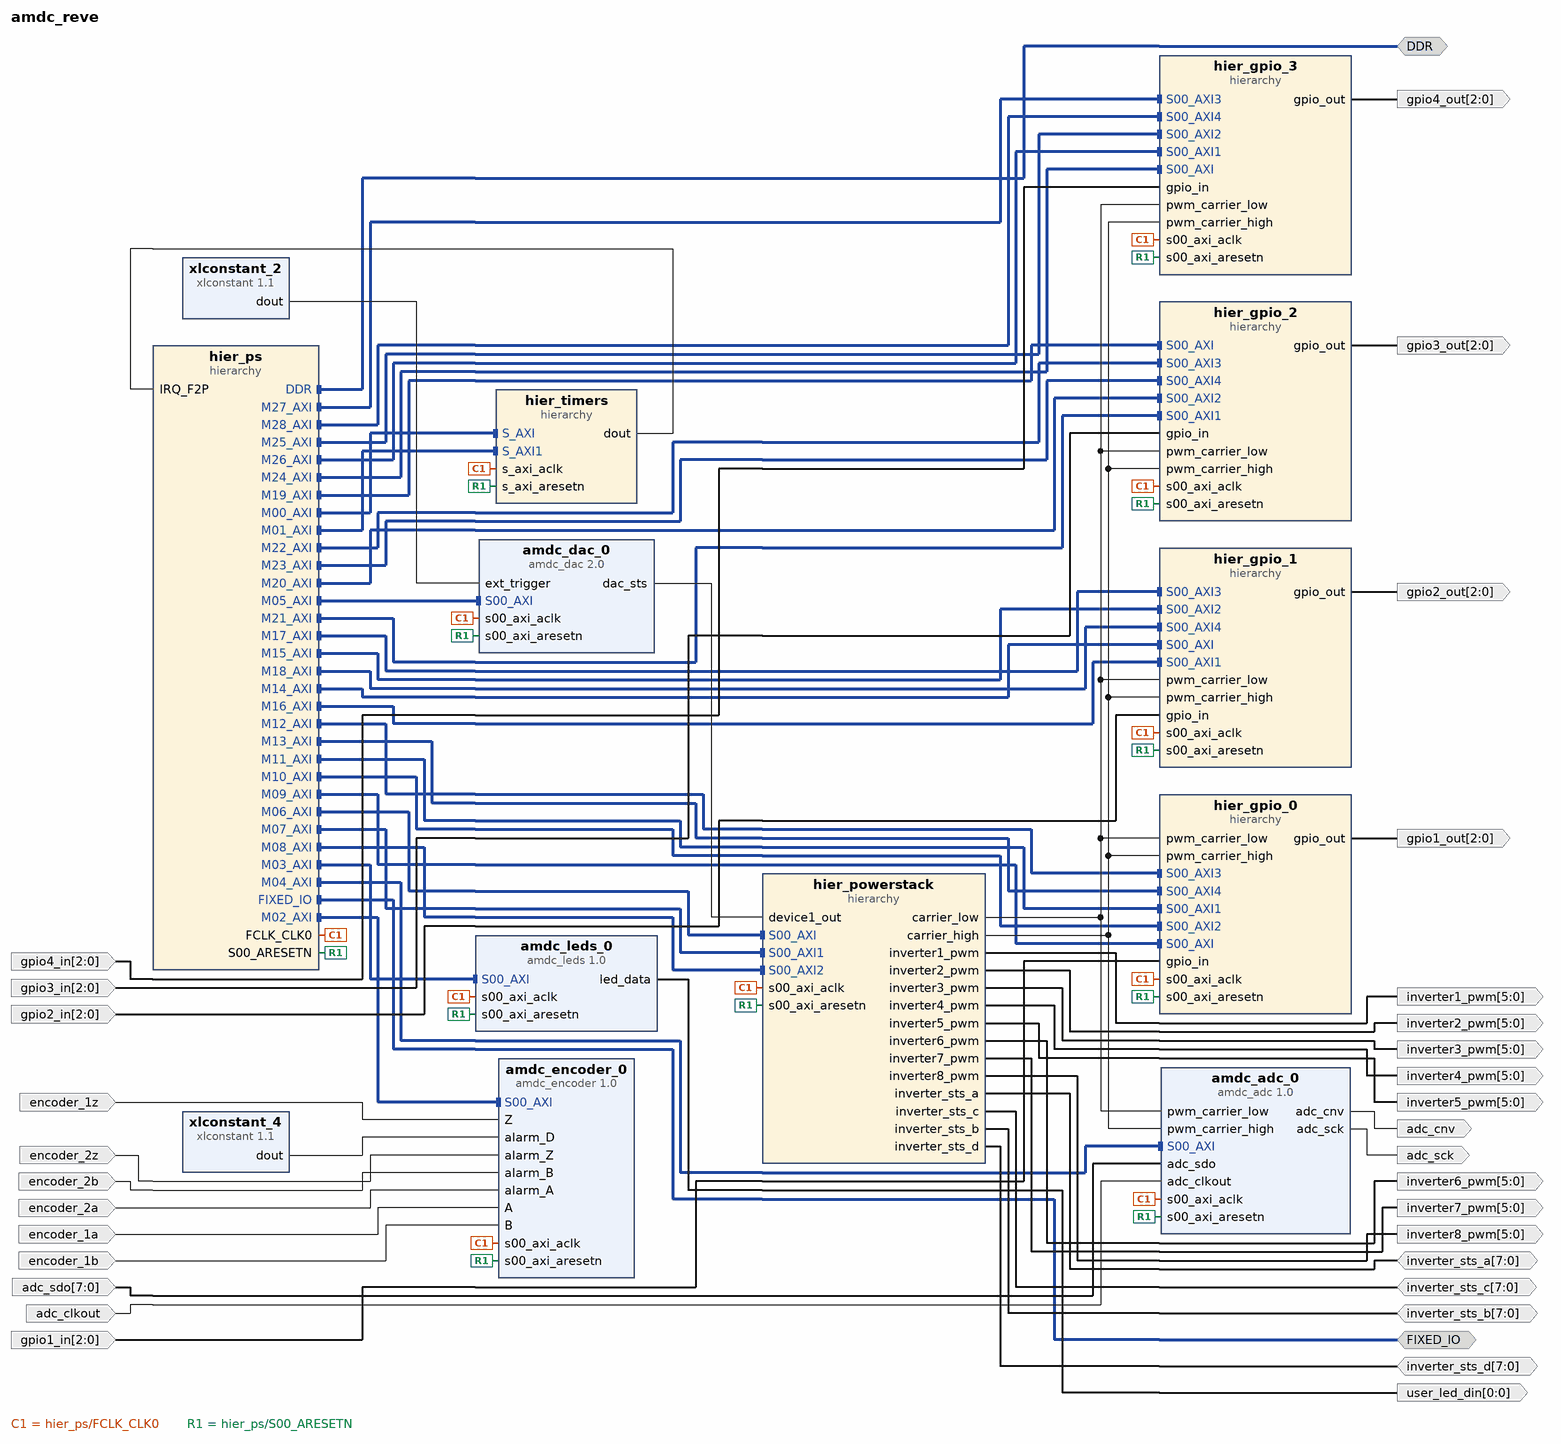
[diagram p0: block diagram of the top level]
# Vivado block design amdc_reve, xc7z030sbg485-1, Vivado 2019.1
create_bd_design amdc_reve

create_bd_intf_port -mode Master -vlnv xilinx.com:interface:ddrx_rtl:1.0 DDR
create_bd_intf_port -mode Master -vlnv xilinx.com:display_processing_system7:fixedio_rtl:1.0 FIXED_IO
create_bd_port -dir I -from 7 -to 0 -type data adc_sdo
create_bd_port -dir I -type data adc_clkout
create_bd_port -dir O -type data adc_sck
create_bd_port -dir O -type data adc_cnv
create_bd_port -dir I -type data encoder_1z
create_bd_port -dir I -type data encoder_2z
create_bd_port -dir I -type data encoder_2b
create_bd_port -dir I -type data encoder_2a
create_bd_port -dir I -type data encoder_1a
create_bd_port -dir I -type data encoder_1b
create_bd_port -dir O -from 5 -to 0 -type data inverter8_pwm
create_bd_port -dir O -from 5 -to 0 -type data inverter7_pwm
create_bd_port -dir O -from 5 -to 0 -type data inverter6_pwm
create_bd_port -dir O -from 5 -to 0 -type data inverter5_pwm
create_bd_port -dir O -from 5 -to 0 -type data inverter4_pwm
create_bd_port -dir O -from 5 -to 0 -type data inverter3_pwm
create_bd_port -dir O -from 5 -to 0 -type data inverter2_pwm
create_bd_port -dir O -from 5 -to 0 -type data inverter1_pwm
create_bd_port -dir O -from 0 -to 0 -type data user_led_din
create_bd_port -dir IO -from 7 -to 0 inverter_sts_a
create_bd_port -dir IO -from 7 -to 0 inverter_sts_b
create_bd_port -dir IO -from 7 -to 0 inverter_sts_c
create_bd_port -dir IO -from 7 -to 0 inverter_sts_d
create_bd_port -dir I -from 2 -to 0 -type data gpio1_in
create_bd_port -dir I -from 2 -to 0 -type data gpio2_in
create_bd_port -dir I -from 2 -to 0 -type data gpio3_in
create_bd_port -dir I -from 2 -to 0 -type data gpio4_in
create_bd_port -dir O -from 2 -to 0 -type data gpio1_out
create_bd_port -dir O -from 2 -to 0 -type data gpio2_out
create_bd_port -dir O -from 2 -to 0 -type data gpio3_out
create_bd_port -dir O -from 2 -to 0 -type data gpio4_out

create_bd_cell -type ip -vlnv wisc.edu:user:amdc_encoder:1.0 amdc_encoder_0
create_bd_cell -type ip -vlnv xilinx.com:ip:xlconstant:1.1 xlconstant_2
set_property -dict {CONFIG.CONST_VAL 0} [get_bd_cells xlconstant_2]
create_bd_cell -type ip -vlnv xilinx.com:ip:xlconstant:1.1 xlconstant_4
set_property -dict {CONFIG.CONST_VAL 0} [get_bd_cells xlconstant_4]
create_bd_cell -type ip -vlnv wisc.edu:user:amdc_leds:1.0 amdc_leds_0
create_bd_cell -type ip -vlnv wisc.edu:user:amdc_adc:1.0 amdc_adc_0
create_bd_cell -type ip -vlnv wisc.edu:user:amdc_dac:2.0 amdc_dac_0
create_bd_cell -type hier hier_ps
create_bd_cell -type hier hier_powerstack
create_bd_cell -type hier hier_gpio_0
create_bd_cell -type hier hier_timers
create_bd_cell -type hier hier_gpio_1
create_bd_cell -type hier hier_gpio_2
create_bd_cell -type hier hier_gpio_3

# ---- hierarchy /hier_ps ----
current_bd_instance /hier_ps
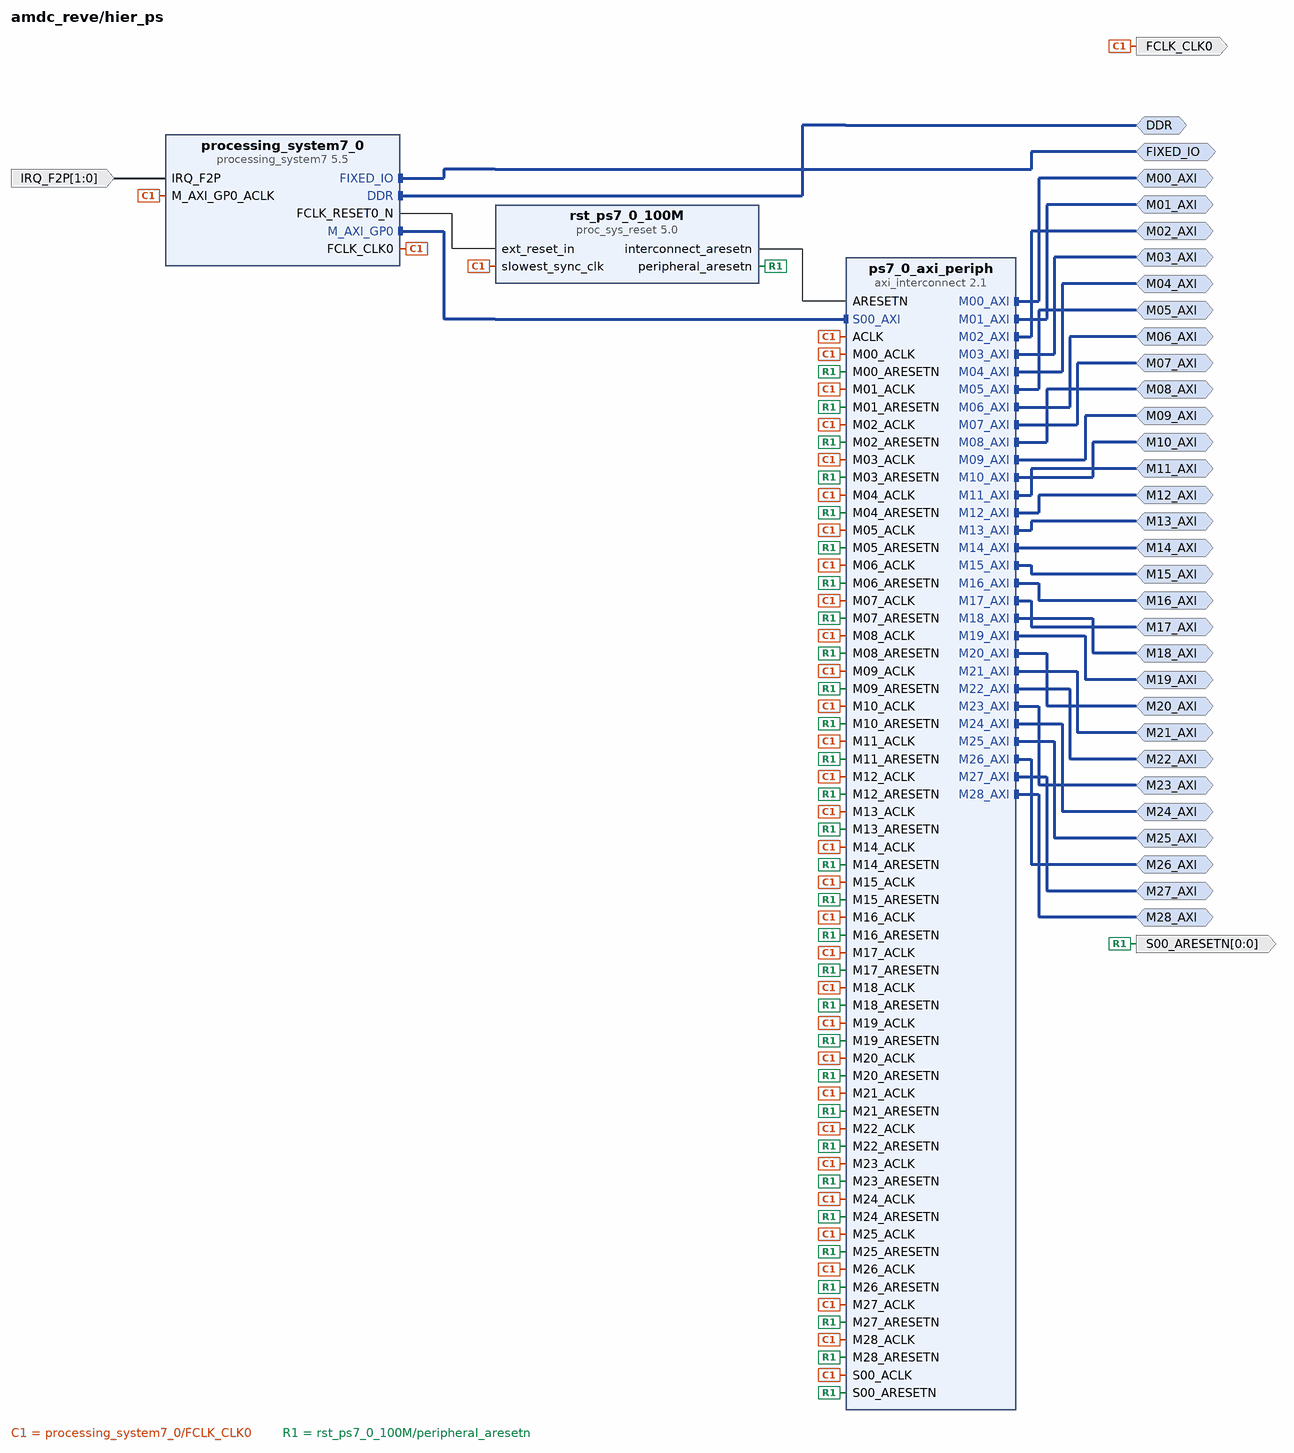
[diagram p1: block diagram inside /hier_ps]
create_bd_intf_pin -mode Master -vlnv xilinx.com:interface:ddrx_rtl:1.0 DDR
create_bd_intf_pin -mode Master -vlnv xilinx.com:display_processing_system7:fixedio_rtl:1.0 FIXED_IO
create_bd_intf_pin -mode Master -vlnv xilinx.com:interface:aximm_rtl:1.0 M00_AXI
create_bd_intf_pin -mode Master -vlnv xilinx.com:interface:aximm_rtl:1.0 M01_AXI
create_bd_intf_pin -mode Master -vlnv xilinx.com:interface:aximm_rtl:1.0 M02_AXI
create_bd_intf_pin -mode Master -vlnv xilinx.com:interface:aximm_rtl:1.0 M03_AXI
create_bd_intf_pin -mode Master -vlnv xilinx.com:interface:aximm_rtl:1.0 M04_AXI
create_bd_intf_pin -mode Master -vlnv xilinx.com:interface:aximm_rtl:1.0 M05_AXI
create_bd_intf_pin -mode Master -vlnv xilinx.com:interface:aximm_rtl:1.0 M06_AXI
create_bd_intf_pin -mode Master -vlnv xilinx.com:interface:aximm_rtl:1.0 M07_AXI
create_bd_intf_pin -mode Master -vlnv xilinx.com:interface:aximm_rtl:1.0 M08_AXI
create_bd_intf_pin -mode Master -vlnv xilinx.com:interface:aximm_rtl:1.0 M09_AXI
create_bd_intf_pin -mode Master -vlnv xilinx.com:interface:aximm_rtl:1.0 M10_AXI
create_bd_intf_pin -mode Master -vlnv xilinx.com:interface:aximm_rtl:1.0 M11_AXI
create_bd_intf_pin -mode Master -vlnv xilinx.com:interface:aximm_rtl:1.0 M12_AXI
create_bd_intf_pin -mode Master -vlnv xilinx.com:interface:aximm_rtl:1.0 M13_AXI
create_bd_intf_pin -mode Master -vlnv xilinx.com:interface:aximm_rtl:1.0 M14_AXI
create_bd_intf_pin -mode Master -vlnv xilinx.com:interface:aximm_rtl:1.0 M15_AXI
create_bd_intf_pin -mode Master -vlnv xilinx.com:interface:aximm_rtl:1.0 M16_AXI
create_bd_intf_pin -mode Master -vlnv xilinx.com:interface:aximm_rtl:1.0 M17_AXI
create_bd_intf_pin -mode Master -vlnv xilinx.com:interface:aximm_rtl:1.0 M18_AXI
create_bd_intf_pin -mode Master -vlnv xilinx.com:interface:aximm_rtl:1.0 M19_AXI
create_bd_intf_pin -mode Master -vlnv xilinx.com:interface:aximm_rtl:1.0 M20_AXI
create_bd_intf_pin -mode Master -vlnv xilinx.com:interface:aximm_rtl:1.0 M21_AXI
create_bd_intf_pin -mode Master -vlnv xilinx.com:interface:aximm_rtl:1.0 M22_AXI
create_bd_intf_pin -mode Master -vlnv xilinx.com:interface:aximm_rtl:1.0 M23_AXI
create_bd_intf_pin -mode Master -vlnv xilinx.com:interface:aximm_rtl:1.0 M24_AXI
create_bd_intf_pin -mode Master -vlnv xilinx.com:interface:aximm_rtl:1.0 M25_AXI
create_bd_intf_pin -mode Master -vlnv xilinx.com:interface:aximm_rtl:1.0 M26_AXI
create_bd_intf_pin -mode Master -vlnv xilinx.com:interface:aximm_rtl:1.0 M27_AXI
create_bd_intf_pin -mode Master -vlnv xilinx.com:interface:aximm_rtl:1.0 M28_AXI
create_bd_pin -dir O -type clk FCLK_CLK0
create_bd_pin -dir O -from 0 -to 0 -type rst S00_ARESETN
create_bd_pin -dir I -from 1 -to 0 -type intr IRQ_F2P

create_bd_cell -type ip -vlnv xilinx.com:ip:processing_system7:5.5 processing_system7_0
set_property -dict [list \
  CONFIG.PCW_APU_PERIPHERAL_FREQMHZ 667 \
  CONFIG.PCW_ENET0_ENET0_IO {MIO 16 .. 27} \
  CONFIG.PCW_ENET0_GRP_MDIO_ENABLE 1 \
  CONFIG.PCW_ENET0_GRP_MDIO_IO {MIO 52 .. 53} \
  CONFIG.PCW_ENET0_PERIPHERAL_ENABLE 1 \
  CONFIG.PCW_ENET0_RESET_ENABLE 0 \
  CONFIG.PCW_ENET_RESET_ENABLE 1 \
  CONFIG.PCW_ENET_RESET_SELECT {Share reset pin} \
  CONFIG.PCW_EN_CLK1_PORT 1 \
  CONFIG.PCW_EN_CLK2_PORT 1 \
  CONFIG.PCW_FCLK_CLK1_BUF TRUE \
  CONFIG.PCW_FCLK_CLK2_BUF TRUE \
  CONFIG.PCW_FPGA0_PERIPHERAL_FREQMHZ 200 \
  CONFIG.PCW_FPGA1_PERIPHERAL_FREQMHZ 50 \
  CONFIG.PCW_FPGA2_PERIPHERAL_FREQMHZ 8 \
  CONFIG.PCW_FPGA_FCLK1_ENABLE 1 \
  CONFIG.PCW_FPGA_FCLK2_ENABLE 1 \
  CONFIG.PCW_GPIO_MIO_GPIO_ENABLE 1 \
  CONFIG.PCW_GPIO_MIO_GPIO_IO MIO \
  CONFIG.PCW_GPIO_PERIPHERAL_ENABLE 1 \
  CONFIG.PCW_I2C_RESET_ENABLE 0 \
  CONFIG.PCW_IRQ_F2P_INTR 1 \
  CONFIG.PCW_P2F_UART0_INTR 1 \
  CONFIG.PCW_PRESET_BANK1_VOLTAGE {LVCMOS 1.8V} \
  CONFIG.PCW_QSPI_GRP_SINGLE_SS_ENABLE 1 \
  CONFIG.PCW_QSPI_GRP_SINGLE_SS_IO {MIO 1 .. 6} \
  CONFIG.PCW_QSPI_PERIPHERAL_ENABLE 1 \
  CONFIG.PCW_QSPI_QSPI_IO {MIO 1 .. 6} \
  CONFIG.PCW_SD0_PERIPHERAL_ENABLE 0 \
  CONFIG.PCW_SD1_GRP_CD_ENABLE 1 \
  CONFIG.PCW_SD1_GRP_CD_IO EMIO \
  CONFIG.PCW_SD1_PERIPHERAL_ENABLE 1 \
  CONFIG.PCW_SD1_SD1_IO {MIO 10 .. 15} \
  CONFIG.PCW_SDIO_PERIPHERAL_FREQMHZ 100 \
  CONFIG.PCW_SINGLE_QSPI_DATA_MODE x4 \
  CONFIG.PCW_UART0_PERIPHERAL_ENABLE 1 \
  CONFIG.PCW_UART0_UART0_IO {MIO 50 .. 51} \
  CONFIG.PCW_UART1_PERIPHERAL_ENABLE 0 \
  CONFIG.PCW_UART_PERIPHERAL_FREQMHZ 50 \
  CONFIG.PCW_UIPARAM_DDR_MEMORY_TYPE {DDR 3 (Low Voltage)} \
  CONFIG.PCW_UIPARAM_DDR_PARTNO {MT41K256M16 RE-125} \
  CONFIG.PCW_USB0_PERIPHERAL_ENABLE 0 \
  CONFIG.PCW_USB_RESET_ENABLE 1 \
  CONFIG.PCW_USE_FABRIC_INTERRUPT 1 \
] [get_bd_cells processing_system7_0]
# 279 more settings of processing_system7_0 are not shown: defaults, MIO pin electricals, DDR timing, and values the tool derives
create_bd_cell -type ip -vlnv xilinx.com:ip:proc_sys_reset:5.0 rst_ps7_0_100M
create_bd_cell -type ip -vlnv xilinx.com:ip:axi_interconnect:2.1 ps7_0_axi_periph
set_property -dict {CONFIG.NUM_MI 29 CONFIG.S00_HAS_DATA_FIFO 2 CONFIG.STRATEGY 2} [get_bd_cells ps7_0_axi_periph]

# ---- hierarchy /hier_powerstack ----
current_bd_instance /hier_powerstack
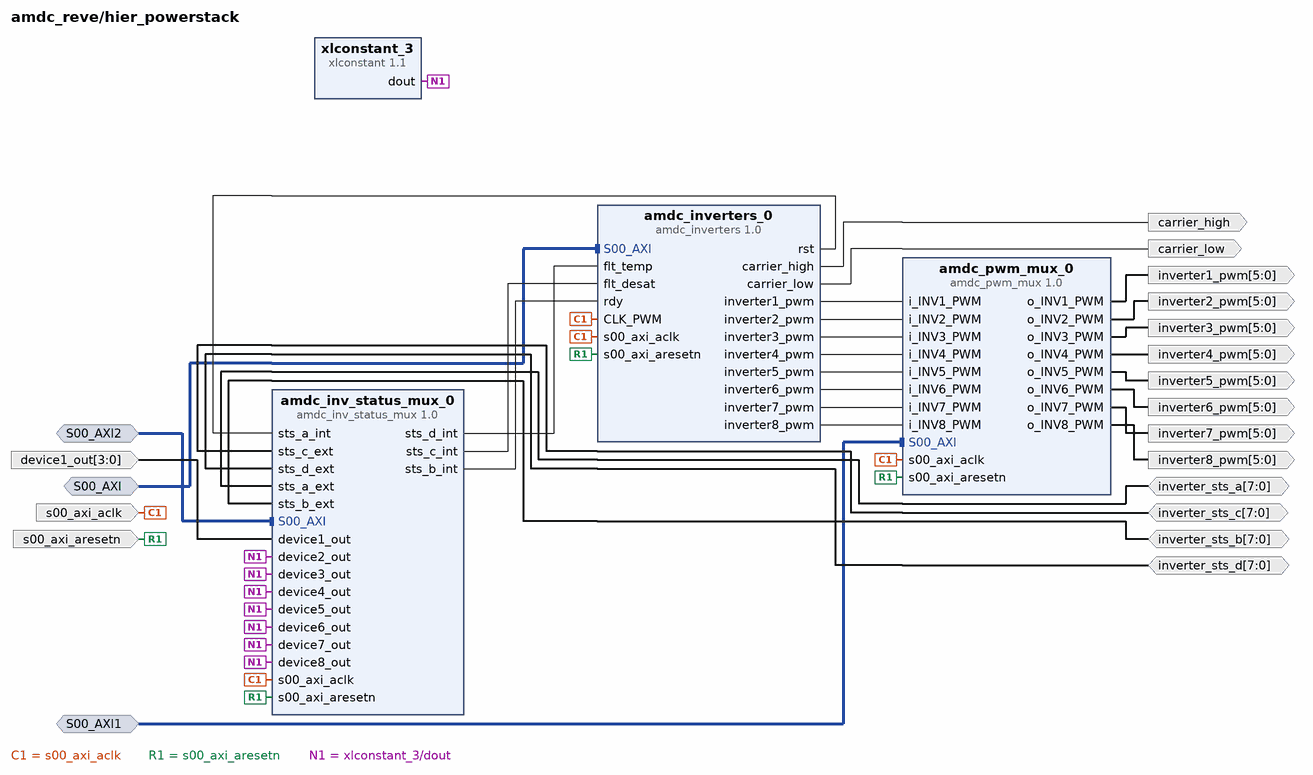
[diagram p2: block diagram inside /hier_powerstack]
create_bd_intf_pin -mode Slave -vlnv xilinx.com:interface:aximm_rtl:1.0 S00_AXI
create_bd_intf_pin -mode Slave -vlnv xilinx.com:interface:aximm_rtl:1.0 S00_AXI1
create_bd_intf_pin -mode Slave -vlnv xilinx.com:interface:aximm_rtl:1.0 S00_AXI2
create_bd_pin -dir I -type clk s00_axi_aclk
create_bd_pin -dir O carrier_high
create_bd_pin -dir O carrier_low
create_bd_pin -dir I -type rst s00_axi_aresetn
create_bd_pin -dir O -from 5 -to 0 inverter1_pwm
create_bd_pin -dir O -from 5 -to 0 inverter2_pwm
create_bd_pin -dir O -from 5 -to 0 inverter3_pwm
create_bd_pin -dir O -from 5 -to 0 inverter4_pwm
create_bd_pin -dir O -from 5 -to 0 inverter5_pwm
create_bd_pin -dir O -from 5 -to 0 inverter6_pwm
create_bd_pin -dir O -from 5 -to 0 inverter7_pwm
create_bd_pin -dir O -from 5 -to 0 inverter8_pwm
create_bd_pin -dir IO -from 7 -to 0 inverter_sts_c
create_bd_pin -dir IO -from 7 -to 0 inverter_sts_d
create_bd_pin -dir I -from 3 -to 0 device1_out
create_bd_pin -dir IO -from 7 -to 0 inverter_sts_a
create_bd_pin -dir IO -from 7 -to 0 inverter_sts_b

create_bd_cell -type ip -vlnv wisc.edu:user:amdc_inverters:1.0 amdc_inverters_0
create_bd_cell -type ip -vlnv wisc.edu:user:amdc_pwm_mux:1.0 amdc_pwm_mux_0
create_bd_cell -type ip -vlnv xilinx.com:user:amdc_inv_status_mux:1.0 amdc_inv_status_mux_0
create_bd_cell -type ip -vlnv xilinx.com:ip:xlconstant:1.1 xlconstant_3
set_property -dict {CONFIG.CONST_VAL 0 CONFIG.CONST_WIDTH 4} [get_bd_cells xlconstant_3]

# ---- hierarchy /hier_gpio_0 ----
current_bd_instance /hier_gpio_0
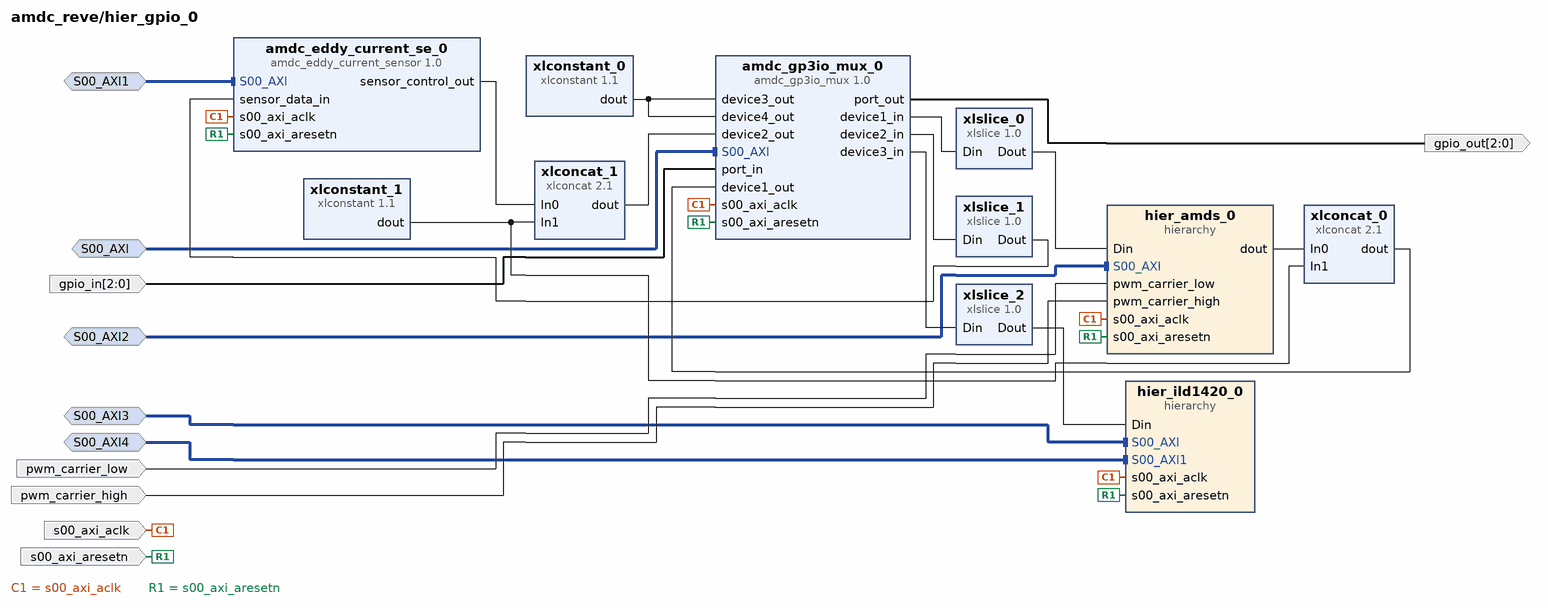
[diagram p3: block diagram inside /hier_gpio_0]
create_bd_intf_pin -mode Slave -vlnv xilinx.com:interface:aximm_rtl:1.0 S00_AXI
create_bd_intf_pin -mode Slave -vlnv xilinx.com:interface:aximm_rtl:1.0 S00_AXI2
create_bd_intf_pin -mode Slave -vlnv xilinx.com:interface:aximm_rtl:1.0 S00_AXI1
create_bd_intf_pin -mode Slave -vlnv xilinx.com:interface:aximm_rtl:1.0 S00_AXI3
create_bd_intf_pin -mode Slave -vlnv xilinx.com:interface:aximm_rtl:1.0 S00_AXI4
create_bd_pin -dir I -from 2 -to 0 gpio_in
create_bd_pin -dir O -from 2 -to 0 gpio_out
create_bd_pin -dir I -type clk s00_axi_aclk
create_bd_pin -dir I -type rst s00_axi_aresetn
create_bd_pin -dir I pwm_carrier_low
create_bd_pin -dir I pwm_carrier_high

create_bd_cell -type hier hier_amds_0
create_bd_cell -type ip -vlnv xilinx.com:user:amdc_eddy_current_sensor:1.0 amdc_eddy_current_se_0
create_bd_cell -type hier hier_ild1420_0
create_bd_cell -type ip -vlnv xilinx.com:ip:xlconstant:1.1 xlconstant_0
set_property -dict {CONFIG.CONST_VAL 0 CONFIG.CONST_WIDTH 3} [get_bd_cells xlconstant_0]
create_bd_cell -type ip -vlnv xilinx.com:user:amdc_gp3io_mux:1.0 amdc_gp3io_mux_0
create_bd_cell -type ip -vlnv xilinx.com:ip:xlconcat:2.1 xlconcat_0
set_property -dict {CONFIG.IN0_WIDTH 2 CONFIG.IN1_WIDTH 1} [get_bd_cells xlconcat_0]
create_bd_cell -type ip -vlnv xilinx.com:ip:xlconstant:1.1 xlconstant_1
set_property -dict {CONFIG.CONST_VAL 0} [get_bd_cells xlconstant_1]
create_bd_cell -type ip -vlnv xilinx.com:ip:xlconcat:2.1 xlconcat_1
set_property -dict {CONFIG.IN0_WIDTH 2 CONFIG.IN1_WIDTH 1} [get_bd_cells xlconcat_1]
create_bd_cell -type ip -vlnv xilinx.com:ip:xlslice:1.0 xlslice_0
set_property -dict {CONFIG.DIN_FROM 1 CONFIG.DIN_TO 0 CONFIG.DIN_WIDTH 3 CONFIG.DOUT_WIDTH 2} [get_bd_cells xlslice_0]
create_bd_cell -type ip -vlnv xilinx.com:ip:xlslice:1.0 xlslice_1
set_property -dict {CONFIG.DIN_FROM 1 CONFIG.DIN_TO 0 CONFIG.DIN_WIDTH 3 CONFIG.DOUT_WIDTH 2} [get_bd_cells xlslice_1]
create_bd_cell -type ip -vlnv xilinx.com:ip:xlslice:1.0 xlslice_2
set_property -dict {CONFIG.DIN_FROM 1 CONFIG.DIN_TO 0 CONFIG.DIN_WIDTH 3 CONFIG.DOUT_WIDTH 2} [get_bd_cells xlslice_2]

# ---- hierarchy /hier_gpio_0/hier_amds_0 ----
current_bd_instance /hier_gpio_0/hier_amds_0
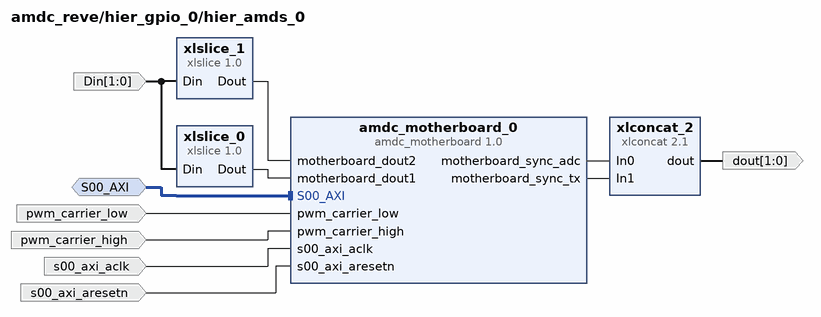
[diagram p4: block diagram inside /hier_gpio_0/hier_amds_0]
create_bd_intf_pin -mode Slave -vlnv xilinx.com:interface:aximm_rtl:1.0 S00_AXI
create_bd_pin -dir I -from 1 -to 0 Din
create_bd_pin -dir O -from 1 -to 0 dout
create_bd_pin -dir I pwm_carrier_low
create_bd_pin -dir I pwm_carrier_high
create_bd_pin -dir I -type clk s00_axi_aclk
create_bd_pin -dir I -type rst s00_axi_aresetn

create_bd_cell -type ip -vlnv xilinx.com:ip:xlslice:1.0 xlslice_0
set_property -dict {CONFIG.DIN_FROM 0 CONFIG.DIN_TO 0 CONFIG.DIN_WIDTH 2} [get_bd_cells xlslice_0]
create_bd_cell -type ip -vlnv xilinx.com:ip:xlconcat:2.1 xlconcat_2
create_bd_cell -type ip -vlnv wisc.edu:user:amdc_motherboard:1.0 amdc_motherboard_0
create_bd_cell -type ip -vlnv xilinx.com:ip:xlslice:1.0 xlslice_1
set_property -dict {CONFIG.DIN_FROM 1 CONFIG.DIN_TO 1 CONFIG.DIN_WIDTH 2 CONFIG.DOUT_WIDTH 1} [get_bd_cells xlslice_1]

# ---- hierarchy /hier_gpio_0/hier_ild1420_0 ----
current_bd_instance /hier_gpio_0/hier_ild1420_0
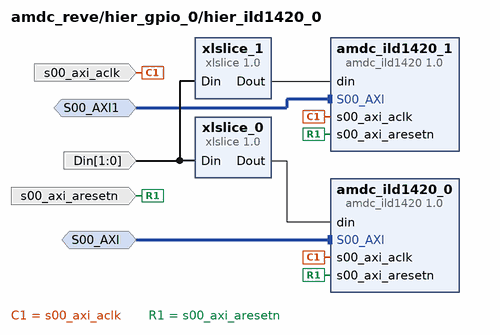
[diagram p5: block diagram inside /hier_gpio_0/hier_ild1420_0]
create_bd_intf_pin -mode Slave -vlnv xilinx.com:interface:aximm_rtl:1.0 S00_AXI
create_bd_intf_pin -mode Slave -vlnv xilinx.com:interface:aximm_rtl:1.0 S00_AXI1
create_bd_pin -dir I -from 1 -to 0 Din
create_bd_pin -dir I -type clk s00_axi_aclk
create_bd_pin -dir I -type rst s00_axi_aresetn

create_bd_cell -type ip -vlnv xilinx.com:ip:xlslice:1.0 xlslice_0
set_property -dict {CONFIG.DIN_FROM 0 CONFIG.DIN_TO 0 CONFIG.DIN_WIDTH 2 CONFIG.DOUT_WIDTH 1} [get_bd_cells xlslice_0]
create_bd_cell -type ip -vlnv xilinx.com:ip:xlslice:1.0 xlslice_1
set_property -dict {CONFIG.DIN_FROM 1 CONFIG.DIN_TO 1 CONFIG.DIN_WIDTH 2 CONFIG.DOUT_WIDTH 1} [get_bd_cells xlslice_1]
create_bd_cell -type ip -vlnv wisc.edu:user:amdc_ild1420:1.0 amdc_ild1420_0
create_bd_cell -type ip -vlnv wisc.edu:user:amdc_ild1420:1.0 amdc_ild1420_1

# ---- hierarchy /hier_timers ----
current_bd_instance /hier_timers
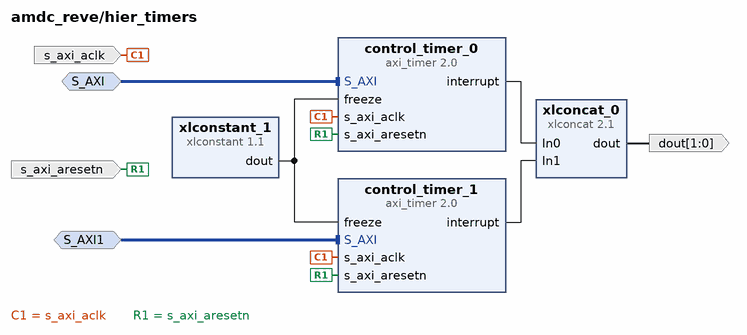
[diagram p6: block diagram inside /hier_timers]
create_bd_intf_pin -mode Slave -vlnv xilinx.com:interface:aximm_rtl:1.0 S_AXI
create_bd_intf_pin -mode Slave -vlnv xilinx.com:interface:aximm_rtl:1.0 S_AXI1
create_bd_pin -dir I -type clk s_axi_aclk
create_bd_pin -dir I -type rst s_axi_aresetn
create_bd_pin -dir O -from 1 -to 0 -type intr dout

create_bd_cell -type ip -vlnv xilinx.com:ip:axi_timer:2.0 control_timer_0
create_bd_cell -type ip -vlnv xilinx.com:ip:axi_timer:2.0 control_timer_1
create_bd_cell -type ip -vlnv xilinx.com:ip:xlconstant:1.1 xlconstant_1
set_property -dict {CONFIG.CONST_VAL 0} [get_bd_cells xlconstant_1]
create_bd_cell -type ip -vlnv xilinx.com:ip:xlconcat:2.1 xlconcat_0
set_property -dict {CONFIG.NUM_PORTS 2} [get_bd_cells xlconcat_0]

# ---- hierarchy /hier_gpio_1 ----
current_bd_instance /hier_gpio_1
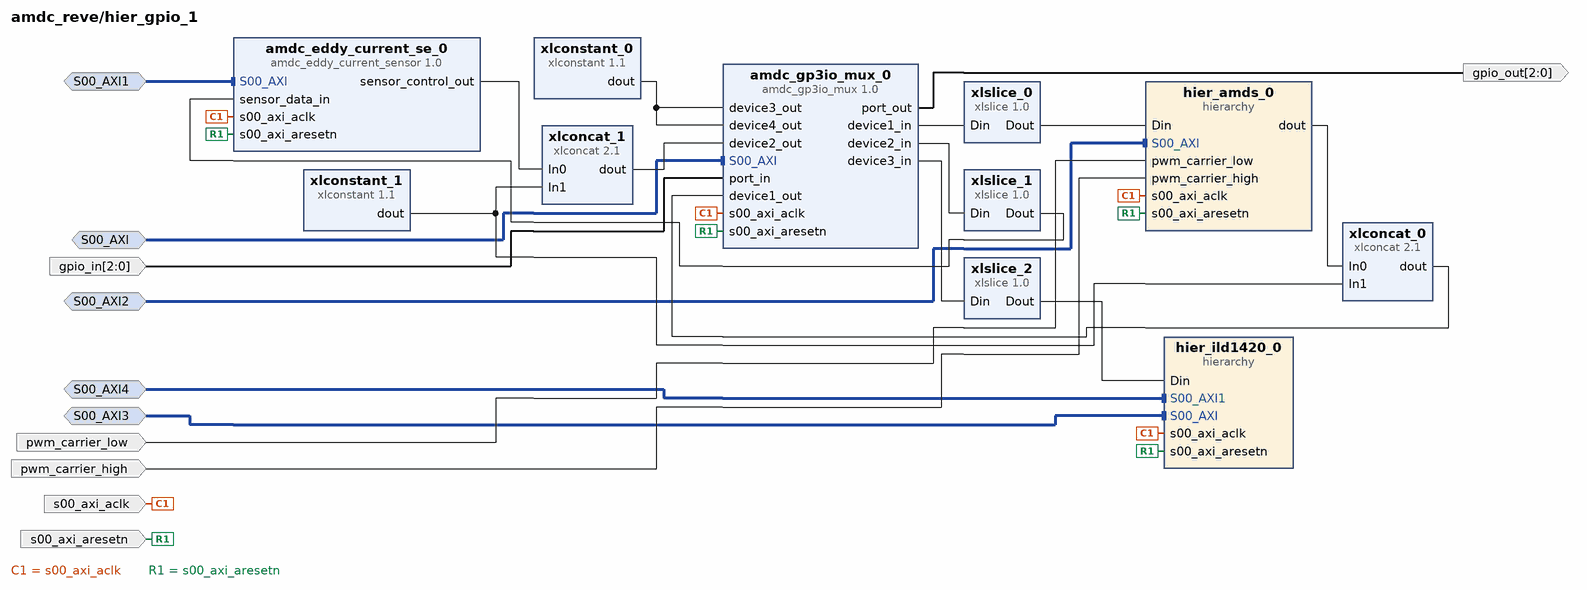
[diagram p7: block diagram inside /hier_gpio_1]
create_bd_intf_pin -mode Slave -vlnv xilinx.com:interface:aximm_rtl:1.0 S00_AXI
create_bd_intf_pin -mode Slave -vlnv xilinx.com:interface:aximm_rtl:1.0 S00_AXI2
create_bd_intf_pin -mode Slave -vlnv xilinx.com:interface:aximm_rtl:1.0 S00_AXI1
create_bd_intf_pin -mode Slave -vlnv xilinx.com:interface:aximm_rtl:1.0 S00_AXI3
create_bd_intf_pin -mode Slave -vlnv xilinx.com:interface:aximm_rtl:1.0 S00_AXI4
create_bd_pin -dir I -from 2 -to 0 gpio_in
create_bd_pin -dir O -from 2 -to 0 gpio_out
create_bd_pin -dir I -type clk s00_axi_aclk
create_bd_pin -dir I -type rst s00_axi_aresetn
create_bd_pin -dir I pwm_carrier_low
create_bd_pin -dir I pwm_carrier_high

create_bd_cell -type hier hier_amds_0
create_bd_cell -type ip -vlnv xilinx.com:user:amdc_eddy_current_sensor:1.0 amdc_eddy_current_se_0
create_bd_cell -type hier hier_ild1420_0
create_bd_cell -type ip -vlnv xilinx.com:ip:xlconstant:1.1 xlconstant_0
set_property -dict {CONFIG.CONST_VAL 0 CONFIG.CONST_WIDTH 3} [get_bd_cells xlconstant_0]
create_bd_cell -type ip -vlnv xilinx.com:user:amdc_gp3io_mux:1.0 amdc_gp3io_mux_0
create_bd_cell -type ip -vlnv xilinx.com:ip:xlconcat:2.1 xlconcat_0
set_property -dict {CONFIG.IN0_WIDTH 2 CONFIG.IN1_WIDTH 1} [get_bd_cells xlconcat_0]
create_bd_cell -type ip -vlnv xilinx.com:ip:xlconstant:1.1 xlconstant_1
set_property -dict {CONFIG.CONST_VAL 0} [get_bd_cells xlconstant_1]
create_bd_cell -type ip -vlnv xilinx.com:ip:xlconcat:2.1 xlconcat_1
set_property -dict {CONFIG.IN0_WIDTH 2 CONFIG.IN1_WIDTH 1} [get_bd_cells xlconcat_1]
create_bd_cell -type ip -vlnv xilinx.com:ip:xlslice:1.0 xlslice_0
set_property -dict {CONFIG.DIN_FROM 1 CONFIG.DIN_TO 0 CONFIG.DIN_WIDTH 3 CONFIG.DOUT_WIDTH 2} [get_bd_cells xlslice_0]
create_bd_cell -type ip -vlnv xilinx.com:ip:xlslice:1.0 xlslice_1
set_property -dict {CONFIG.DIN_FROM 1 CONFIG.DIN_TO 0 CONFIG.DIN_WIDTH 3 CONFIG.DOUT_WIDTH 2} [get_bd_cells xlslice_1]
create_bd_cell -type ip -vlnv xilinx.com:ip:xlslice:1.0 xlslice_2
set_property -dict {CONFIG.DIN_FROM 1 CONFIG.DIN_TO 0 CONFIG.DIN_WIDTH 3 CONFIG.DOUT_WIDTH 2} [get_bd_cells xlslice_2]

# ---- hierarchy /hier_gpio_1/hier_amds_0 ----
current_bd_instance /hier_gpio_1/hier_amds_0
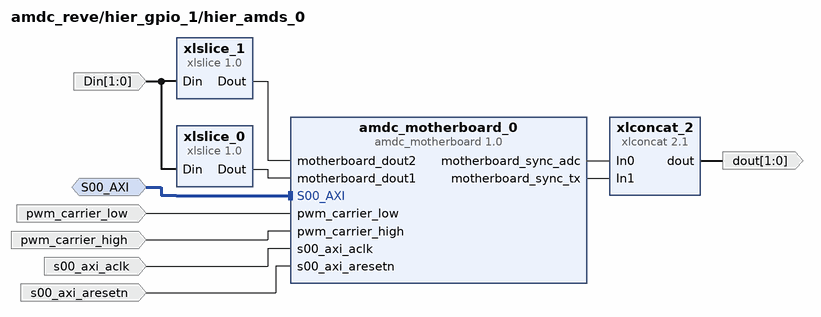
[diagram p8: block diagram inside /hier_gpio_1/hier_amds_0]
create_bd_intf_pin -mode Slave -vlnv xilinx.com:interface:aximm_rtl:1.0 S00_AXI
create_bd_pin -dir I -from 1 -to 0 Din
create_bd_pin -dir O -from 1 -to 0 dout
create_bd_pin -dir I pwm_carrier_low
create_bd_pin -dir I pwm_carrier_high
create_bd_pin -dir I -type clk s00_axi_aclk
create_bd_pin -dir I -type rst s00_axi_aresetn

create_bd_cell -type ip -vlnv xilinx.com:ip:xlslice:1.0 xlslice_0
set_property -dict {CONFIG.DIN_FROM 0 CONFIG.DIN_TO 0 CONFIG.DIN_WIDTH 2} [get_bd_cells xlslice_0]
create_bd_cell -type ip -vlnv xilinx.com:ip:xlconcat:2.1 xlconcat_2
create_bd_cell -type ip -vlnv wisc.edu:user:amdc_motherboard:1.0 amdc_motherboard_0
create_bd_cell -type ip -vlnv xilinx.com:ip:xlslice:1.0 xlslice_1
set_property -dict {CONFIG.DIN_FROM 1 CONFIG.DIN_TO 1 CONFIG.DIN_WIDTH 2 CONFIG.DOUT_WIDTH 1} [get_bd_cells xlslice_1]

# ---- hierarchy /hier_gpio_1/hier_ild1420_0 ----
current_bd_instance /hier_gpio_1/hier_ild1420_0
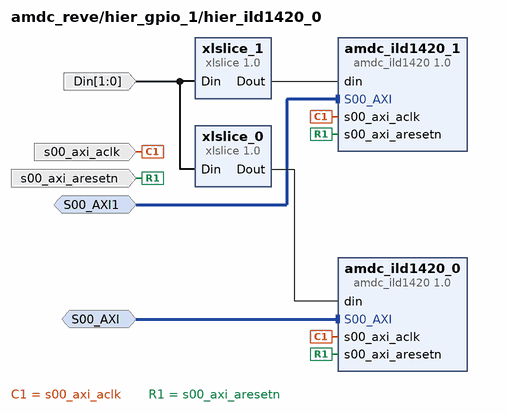
[diagram p9: block diagram inside /hier_gpio_1/hier_ild1420_0]
create_bd_intf_pin -mode Slave -vlnv xilinx.com:interface:aximm_rtl:1.0 S00_AXI
create_bd_intf_pin -mode Slave -vlnv xilinx.com:interface:aximm_rtl:1.0 S00_AXI1
create_bd_pin -dir I -from 1 -to 0 Din
create_bd_pin -dir I -type clk s00_axi_aclk
create_bd_pin -dir I -type rst s00_axi_aresetn

create_bd_cell -type ip -vlnv xilinx.com:ip:xlslice:1.0 xlslice_0
set_property -dict {CONFIG.DIN_FROM 0 CONFIG.DIN_TO 0 CONFIG.DIN_WIDTH 2 CONFIG.DOUT_WIDTH 1} [get_bd_cells xlslice_0]
create_bd_cell -type ip -vlnv xilinx.com:ip:xlslice:1.0 xlslice_1
set_property -dict {CONFIG.DIN_FROM 1 CONFIG.DIN_TO 1 CONFIG.DIN_WIDTH 2 CONFIG.DOUT_WIDTH 1} [get_bd_cells xlslice_1]
create_bd_cell -type ip -vlnv wisc.edu:user:amdc_ild1420:1.0 amdc_ild1420_0
create_bd_cell -type ip -vlnv wisc.edu:user:amdc_ild1420:1.0 amdc_ild1420_1

# ---- hierarchy /hier_gpio_2 ----
current_bd_instance /hier_gpio_2
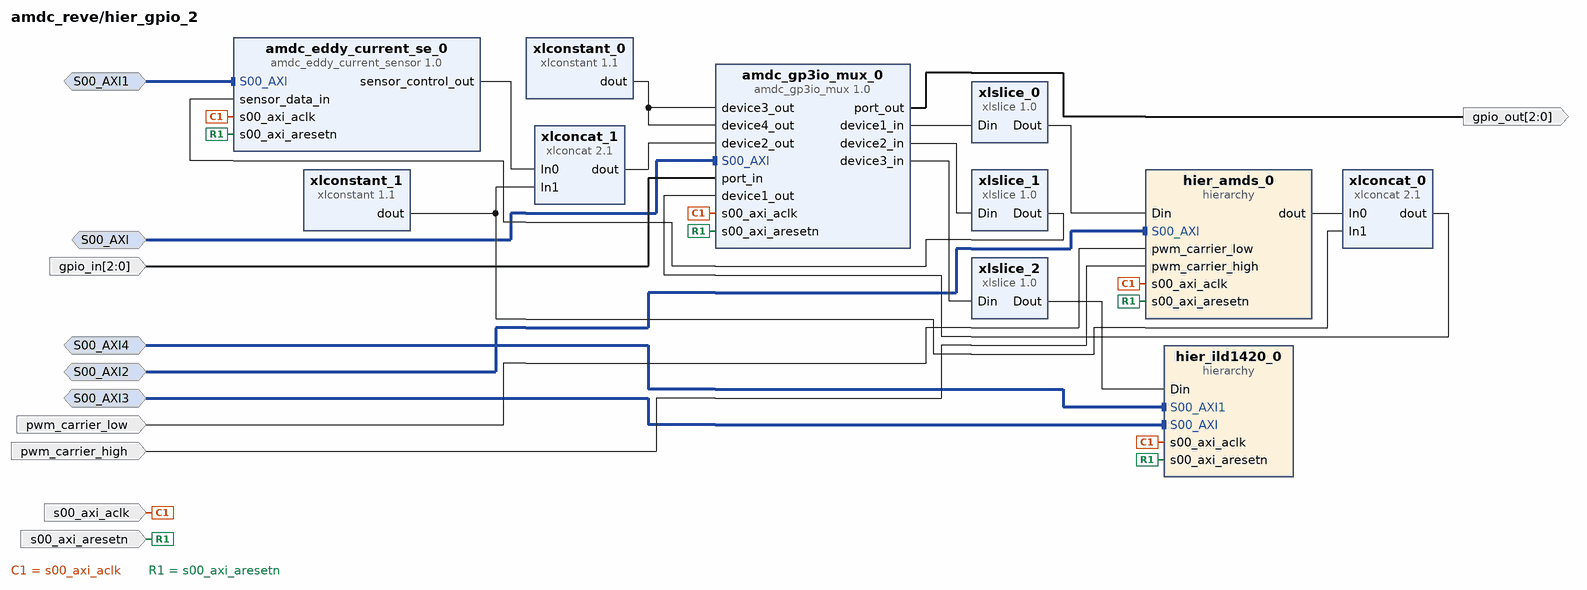
[diagram p10: block diagram inside /hier_gpio_2]
create_bd_intf_pin -mode Slave -vlnv xilinx.com:interface:aximm_rtl:1.0 S00_AXI
create_bd_intf_pin -mode Slave -vlnv xilinx.com:interface:aximm_rtl:1.0 S00_AXI2
create_bd_intf_pin -mode Slave -vlnv xilinx.com:interface:aximm_rtl:1.0 S00_AXI1
create_bd_intf_pin -mode Slave -vlnv xilinx.com:interface:aximm_rtl:1.0 S00_AXI3
create_bd_intf_pin -mode Slave -vlnv xilinx.com:interface:aximm_rtl:1.0 S00_AXI4
create_bd_pin -dir I -from 2 -to 0 gpio_in
create_bd_pin -dir O -from 2 -to 0 gpio_out
create_bd_pin -dir I -type clk s00_axi_aclk
create_bd_pin -dir I -type rst s00_axi_aresetn
create_bd_pin -dir I pwm_carrier_low
create_bd_pin -dir I pwm_carrier_high

create_bd_cell -type hier hier_amds_0
create_bd_cell -type ip -vlnv xilinx.com:user:amdc_eddy_current_sensor:1.0 amdc_eddy_current_se_0
create_bd_cell -type hier hier_ild1420_0
create_bd_cell -type ip -vlnv xilinx.com:ip:xlconstant:1.1 xlconstant_0
set_property -dict {CONFIG.CONST_VAL 0 CONFIG.CONST_WIDTH 3} [get_bd_cells xlconstant_0]
create_bd_cell -type ip -vlnv xilinx.com:user:amdc_gp3io_mux:1.0 amdc_gp3io_mux_0
create_bd_cell -type ip -vlnv xilinx.com:ip:xlconcat:2.1 xlconcat_0
set_property -dict {CONFIG.IN0_WIDTH 2 CONFIG.IN1_WIDTH 1} [get_bd_cells xlconcat_0]
create_bd_cell -type ip -vlnv xilinx.com:ip:xlconstant:1.1 xlconstant_1
set_property -dict {CONFIG.CONST_VAL 0} [get_bd_cells xlconstant_1]
create_bd_cell -type ip -vlnv xilinx.com:ip:xlconcat:2.1 xlconcat_1
set_property -dict {CONFIG.IN0_WIDTH 2 CONFIG.IN1_WIDTH 1} [get_bd_cells xlconcat_1]
create_bd_cell -type ip -vlnv xilinx.com:ip:xlslice:1.0 xlslice_0
set_property -dict {CONFIG.DIN_FROM 1 CONFIG.DIN_TO 0 CONFIG.DIN_WIDTH 3 CONFIG.DOUT_WIDTH 2} [get_bd_cells xlslice_0]
create_bd_cell -type ip -vlnv xilinx.com:ip:xlslice:1.0 xlslice_1
set_property -dict {CONFIG.DIN_FROM 1 CONFIG.DIN_TO 0 CONFIG.DIN_WIDTH 3 CONFIG.DOUT_WIDTH 2} [get_bd_cells xlslice_1]
create_bd_cell -type ip -vlnv xilinx.com:ip:xlslice:1.0 xlslice_2
set_property -dict {CONFIG.DIN_FROM 1 CONFIG.DIN_TO 0 CONFIG.DIN_WIDTH 3 CONFIG.DOUT_WIDTH 2} [get_bd_cells xlslice_2]

# ---- hierarchy /hier_gpio_2/hier_amds_0 ----
current_bd_instance /hier_gpio_2/hier_amds_0
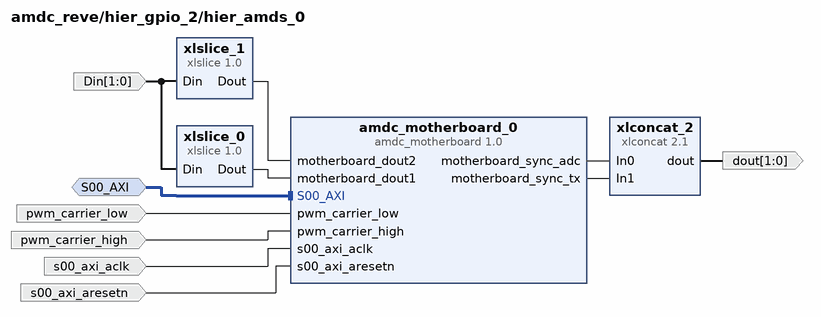
[diagram p11: block diagram inside /hier_gpio_2/hier_amds_0]
create_bd_intf_pin -mode Slave -vlnv xilinx.com:interface:aximm_rtl:1.0 S00_AXI
create_bd_pin -dir I -from 1 -to 0 Din
create_bd_pin -dir O -from 1 -to 0 dout
create_bd_pin -dir I pwm_carrier_low
create_bd_pin -dir I pwm_carrier_high
create_bd_pin -dir I -type clk s00_axi_aclk
create_bd_pin -dir I -type rst s00_axi_aresetn

create_bd_cell -type ip -vlnv xilinx.com:ip:xlslice:1.0 xlslice_0
set_property -dict {CONFIG.DIN_FROM 0 CONFIG.DIN_TO 0 CONFIG.DIN_WIDTH 2} [get_bd_cells xlslice_0]
create_bd_cell -type ip -vlnv xilinx.com:ip:xlconcat:2.1 xlconcat_2
create_bd_cell -type ip -vlnv wisc.edu:user:amdc_motherboard:1.0 amdc_motherboard_0
create_bd_cell -type ip -vlnv xilinx.com:ip:xlslice:1.0 xlslice_1
set_property -dict {CONFIG.DIN_FROM 1 CONFIG.DIN_TO 1 CONFIG.DIN_WIDTH 2 CONFIG.DOUT_WIDTH 1} [get_bd_cells xlslice_1]

# ---- hierarchy /hier_gpio_2/hier_ild1420_0 ----
current_bd_instance /hier_gpio_2/hier_ild1420_0
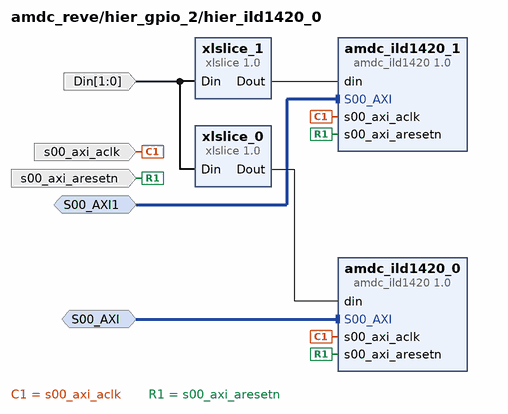
[diagram p12: block diagram inside /hier_gpio_2/hier_ild1420_0]
create_bd_intf_pin -mode Slave -vlnv xilinx.com:interface:aximm_rtl:1.0 S00_AXI
create_bd_intf_pin -mode Slave -vlnv xilinx.com:interface:aximm_rtl:1.0 S00_AXI1
create_bd_pin -dir I -from 1 -to 0 Din
create_bd_pin -dir I -type clk s00_axi_aclk
create_bd_pin -dir I -type rst s00_axi_aresetn

create_bd_cell -type ip -vlnv xilinx.com:ip:xlslice:1.0 xlslice_0
set_property -dict {CONFIG.DIN_FROM 0 CONFIG.DIN_TO 0 CONFIG.DIN_WIDTH 2 CONFIG.DOUT_WIDTH 1} [get_bd_cells xlslice_0]
create_bd_cell -type ip -vlnv xilinx.com:ip:xlslice:1.0 xlslice_1
set_property -dict {CONFIG.DIN_FROM 1 CONFIG.DIN_TO 1 CONFIG.DIN_WIDTH 2 CONFIG.DOUT_WIDTH 1} [get_bd_cells xlslice_1]
create_bd_cell -type ip -vlnv wisc.edu:user:amdc_ild1420:1.0 amdc_ild1420_0
create_bd_cell -type ip -vlnv wisc.edu:user:amdc_ild1420:1.0 amdc_ild1420_1

# ---- hierarchy /hier_gpio_3 ----
current_bd_instance /hier_gpio_3
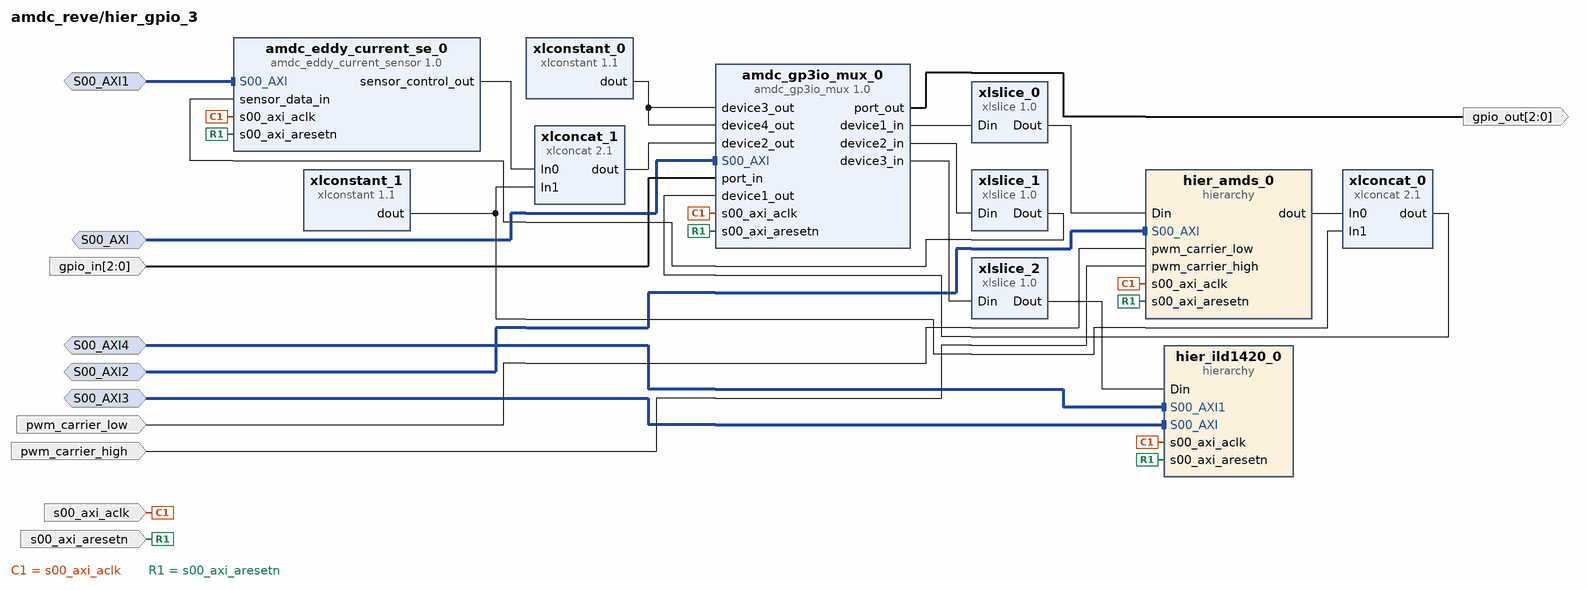
[diagram p13: block diagram inside /hier_gpio_3]
create_bd_intf_pin -mode Slave -vlnv xilinx.com:interface:aximm_rtl:1.0 S00_AXI
create_bd_intf_pin -mode Slave -vlnv xilinx.com:interface:aximm_rtl:1.0 S00_AXI2
create_bd_intf_pin -mode Slave -vlnv xilinx.com:interface:aximm_rtl:1.0 S00_AXI1
create_bd_intf_pin -mode Slave -vlnv xilinx.com:interface:aximm_rtl:1.0 S00_AXI3
create_bd_intf_pin -mode Slave -vlnv xilinx.com:interface:aximm_rtl:1.0 S00_AXI4
create_bd_pin -dir I -from 2 -to 0 gpio_in
create_bd_pin -dir O -from 2 -to 0 gpio_out
create_bd_pin -dir I -type clk s00_axi_aclk
create_bd_pin -dir I -type rst s00_axi_aresetn
create_bd_pin -dir I pwm_carrier_low
create_bd_pin -dir I pwm_carrier_high

create_bd_cell -type hier hier_amds_0
create_bd_cell -type ip -vlnv xilinx.com:user:amdc_eddy_current_sensor:1.0 amdc_eddy_current_se_0
create_bd_cell -type hier hier_ild1420_0
create_bd_cell -type ip -vlnv xilinx.com:ip:xlconstant:1.1 xlconstant_0
set_property -dict {CONFIG.CONST_VAL 0 CONFIG.CONST_WIDTH 3} [get_bd_cells xlconstant_0]
create_bd_cell -type ip -vlnv xilinx.com:user:amdc_gp3io_mux:1.0 amdc_gp3io_mux_0
create_bd_cell -type ip -vlnv xilinx.com:ip:xlconcat:2.1 xlconcat_0
set_property -dict {CONFIG.IN0_WIDTH 2 CONFIG.IN1_WIDTH 1} [get_bd_cells xlconcat_0]
create_bd_cell -type ip -vlnv xilinx.com:ip:xlconstant:1.1 xlconstant_1
set_property -dict {CONFIG.CONST_VAL 0} [get_bd_cells xlconstant_1]
create_bd_cell -type ip -vlnv xilinx.com:ip:xlconcat:2.1 xlconcat_1
set_property -dict {CONFIG.IN0_WIDTH 2 CONFIG.IN1_WIDTH 1} [get_bd_cells xlconcat_1]
create_bd_cell -type ip -vlnv xilinx.com:ip:xlslice:1.0 xlslice_0
set_property -dict {CONFIG.DIN_FROM 1 CONFIG.DIN_TO 0 CONFIG.DIN_WIDTH 3 CONFIG.DOUT_WIDTH 2} [get_bd_cells xlslice_0]
create_bd_cell -type ip -vlnv xilinx.com:ip:xlslice:1.0 xlslice_1
set_property -dict {CONFIG.DIN_FROM 1 CONFIG.DIN_TO 0 CONFIG.DIN_WIDTH 3 CONFIG.DOUT_WIDTH 2} [get_bd_cells xlslice_1]
create_bd_cell -type ip -vlnv xilinx.com:ip:xlslice:1.0 xlslice_2
set_property -dict {CONFIG.DIN_FROM 1 CONFIG.DIN_TO 0 CONFIG.DIN_WIDTH 3 CONFIG.DOUT_WIDTH 2} [get_bd_cells xlslice_2]

# ---- hierarchy /hier_gpio_3/hier_amds_0 ----
current_bd_instance /hier_gpio_3/hier_amds_0
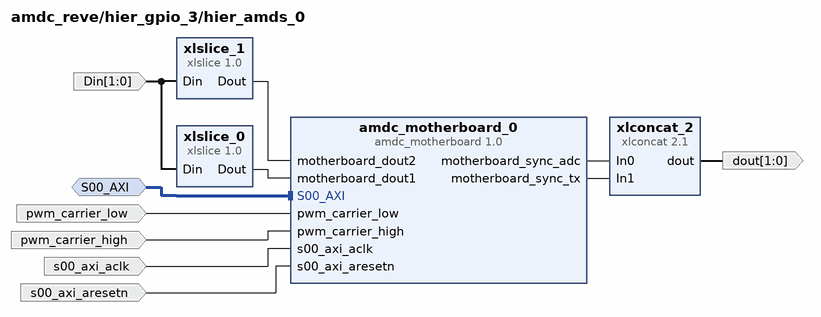
[diagram p14: block diagram inside /hier_gpio_3/hier_amds_0]
create_bd_intf_pin -mode Slave -vlnv xilinx.com:interface:aximm_rtl:1.0 S00_AXI
create_bd_pin -dir I -from 1 -to 0 Din
create_bd_pin -dir O -from 1 -to 0 dout
create_bd_pin -dir I pwm_carrier_low
create_bd_pin -dir I pwm_carrier_high
create_bd_pin -dir I -type clk s00_axi_aclk
create_bd_pin -dir I -type rst s00_axi_aresetn

create_bd_cell -type ip -vlnv xilinx.com:ip:xlslice:1.0 xlslice_0
set_property -dict {CONFIG.DIN_FROM 0 CONFIG.DIN_TO 0 CONFIG.DIN_WIDTH 2} [get_bd_cells xlslice_0]
create_bd_cell -type ip -vlnv xilinx.com:ip:xlconcat:2.1 xlconcat_2
create_bd_cell -type ip -vlnv wisc.edu:user:amdc_motherboard:1.0 amdc_motherboard_0
create_bd_cell -type ip -vlnv xilinx.com:ip:xlslice:1.0 xlslice_1
set_property -dict {CONFIG.DIN_FROM 1 CONFIG.DIN_TO 1 CONFIG.DIN_WIDTH 2 CONFIG.DOUT_WIDTH 1} [get_bd_cells xlslice_1]

# ---- hierarchy /hier_gpio_3/hier_ild1420_0 ----
current_bd_instance /hier_gpio_3/hier_ild1420_0
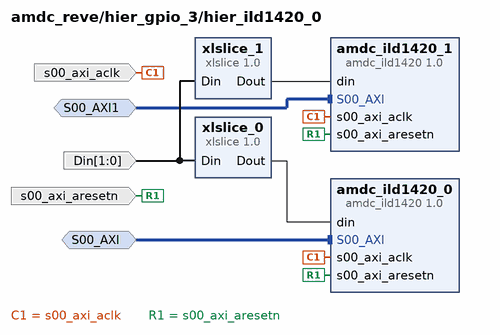
[diagram p15: block diagram inside /hier_gpio_3/hier_ild1420_0]
create_bd_intf_pin -mode Slave -vlnv xilinx.com:interface:aximm_rtl:1.0 S00_AXI
create_bd_intf_pin -mode Slave -vlnv xilinx.com:interface:aximm_rtl:1.0 S00_AXI1
create_bd_pin -dir I -from 1 -to 0 Din
create_bd_pin -dir I -type clk s00_axi_aclk
create_bd_pin -dir I -type rst s00_axi_aresetn

create_bd_cell -type ip -vlnv xilinx.com:ip:xlslice:1.0 xlslice_0
set_property -dict {CONFIG.DIN_FROM 0 CONFIG.DIN_TO 0 CONFIG.DIN_WIDTH 2 CONFIG.DOUT_WIDTH 1} [get_bd_cells xlslice_0]
create_bd_cell -type ip -vlnv xilinx.com:ip:xlslice:1.0 xlslice_1
set_property -dict {CONFIG.DIN_FROM 1 CONFIG.DIN_TO 1 CONFIG.DIN_WIDTH 2 CONFIG.DOUT_WIDTH 1} [get_bd_cells xlslice_1]
create_bd_cell -type ip -vlnv wisc.edu:user:amdc_ild1420:1.0 amdc_ild1420_0
create_bd_cell -type ip -vlnv wisc.edu:user:amdc_ild1420:1.0 amdc_ild1420_1

# ---- connections ----

current_bd_instance /hier_ps
connect_bd_intf_net [get_bd_intf_pins M22_AXI] [get_bd_intf_pins ps7_0_axi_periph/M22_AXI]
connect_bd_intf_net [get_bd_intf_pins M06_AXI] [get_bd_intf_pins ps7_0_axi_periph/M06_AXI]
connect_bd_intf_net [get_bd_intf_pins M11_AXI] [get_bd_intf_pins ps7_0_axi_periph/M11_AXI]
connect_bd_intf_net [get_bd_intf_pins M13_AXI] [get_bd_intf_pins ps7_0_axi_periph/M13_AXI]
connect_bd_intf_net [get_bd_intf_pins M15_AXI] [get_bd_intf_pins ps7_0_axi_periph/M15_AXI]
connect_bd_intf_net [get_bd_intf_pins M21_AXI] [get_bd_intf_pins ps7_0_axi_periph/M21_AXI]
connect_bd_intf_net [get_bd_intf_pins M23_AXI] [get_bd_intf_pins ps7_0_axi_periph/M23_AXI]
connect_bd_intf_net [get_bd_intf_pins M25_AXI] [get_bd_intf_pins ps7_0_axi_periph/M25_AXI]
connect_bd_intf_net [get_bd_intf_pins M16_AXI] [get_bd_intf_pins ps7_0_axi_periph/M16_AXI]
connect_bd_intf_net [get_bd_intf_pins M24_AXI] [get_bd_intf_pins ps7_0_axi_periph/M24_AXI]
connect_bd_intf_net [get_bd_intf_pins M18_AXI] [get_bd_intf_pins ps7_0_axi_periph/M18_AXI]
connect_bd_intf_net [get_bd_intf_pins M19_AXI] [get_bd_intf_pins ps7_0_axi_periph/M19_AXI]
connect_bd_intf_net [get_bd_intf_pins M27_AXI] [get_bd_intf_pins ps7_0_axi_periph/M27_AXI]
connect_bd_intf_net [get_bd_intf_pins M20_AXI] [get_bd_intf_pins ps7_0_axi_periph/M20_AXI]
connect_bd_intf_net [get_bd_intf_pins M26_AXI] [get_bd_intf_pins ps7_0_axi_periph/M26_AXI]
connect_bd_intf_net [get_bd_intf_pins M28_AXI] [get_bd_intf_pins ps7_0_axi_periph/M28_AXI]
connect_bd_intf_net [get_bd_intf_pins M14_AXI] [get_bd_intf_pins ps7_0_axi_periph/M14_AXI]
connect_bd_intf_net [get_bd_intf_pins M03_AXI] [get_bd_intf_pins ps7_0_axi_periph/M03_AXI]
connect_bd_intf_net [get_bd_intf_pins M17_AXI] [get_bd_intf_pins ps7_0_axi_periph/M17_AXI]
connect_bd_intf_net [get_bd_intf_pins FIXED_IO] [get_bd_intf_pins processing_system7_0/FIXED_IO]
connect_bd_intf_net [get_bd_intf_pins M10_AXI] [get_bd_intf_pins ps7_0_axi_periph/M10_AXI]
connect_bd_intf_net [get_bd_intf_pins processing_system7_0/M_AXI_GP0] [get_bd_intf_pins ps7_0_axi_periph/S00_AXI]
connect_bd_intf_net [get_bd_intf_pins M08_AXI] [get_bd_intf_pins ps7_0_axi_periph/M08_AXI]
connect_bd_intf_net [get_bd_intf_pins M00_AXI] [get_bd_intf_pins ps7_0_axi_periph/M00_AXI]
connect_bd_intf_net [get_bd_intf_pins DDR] [get_bd_intf_pins processing_system7_0/DDR]
connect_bd_intf_net [get_bd_intf_pins M02_AXI] [get_bd_intf_pins ps7_0_axi_periph/M02_AXI]
connect_bd_intf_net [get_bd_intf_pins M01_AXI] [get_bd_intf_pins ps7_0_axi_periph/M01_AXI]
connect_bd_intf_net [get_bd_intf_pins M04_AXI] [get_bd_intf_pins ps7_0_axi_periph/M04_AXI]
connect_bd_intf_net [get_bd_intf_pins M05_AXI] [get_bd_intf_pins ps7_0_axi_periph/M05_AXI]
connect_bd_intf_net [get_bd_intf_pins M09_AXI] [get_bd_intf_pins ps7_0_axi_periph/M09_AXI]
connect_bd_intf_net [get_bd_intf_pins M12_AXI] [get_bd_intf_pins ps7_0_axi_periph/M12_AXI]
connect_bd_intf_net [get_bd_intf_pins M07_AXI] [get_bd_intf_pins ps7_0_axi_periph/M07_AXI]
connect_bd_net [get_bd_pins processing_system7_0/FCLK_RESET0_N] [get_bd_pins rst_ps7_0_100M/ext_reset_in]
connect_bd_net [get_bd_pins processing_system7_0/FCLK_CLK0] \
  [get_bd_pins FCLK_CLK0] [get_bd_pins rst_ps7_0_100M/slowest_sync_clk] [get_bd_pins processing_system7_0/M_AXI_GP0_ACLK] \
  [get_bd_pins ps7_0_axi_periph/ACLK] [get_bd_pins ps7_0_axi_periph/S00_ACLK] [get_bd_pins ps7_0_axi_periph/M00_ACLK] \
  [get_bd_pins ps7_0_axi_periph/M01_ACLK] [get_bd_pins ps7_0_axi_periph/M02_ACLK] [get_bd_pins ps7_0_axi_periph/M03_ACLK] \
  [get_bd_pins ps7_0_axi_periph/M04_ACLK] [get_bd_pins ps7_0_axi_periph/M05_ACLK] [get_bd_pins ps7_0_axi_periph/M06_ACLK] \
  [get_bd_pins ps7_0_axi_periph/M07_ACLK] [get_bd_pins ps7_0_axi_periph/M08_ACLK] [get_bd_pins ps7_0_axi_periph/M09_ACLK] \
  [get_bd_pins ps7_0_axi_periph/M10_ACLK] [get_bd_pins ps7_0_axi_periph/M11_ACLK] [get_bd_pins ps7_0_axi_periph/M12_ACLK] \
  [get_bd_pins ps7_0_axi_periph/M13_ACLK] [get_bd_pins ps7_0_axi_periph/M14_ACLK] [get_bd_pins ps7_0_axi_periph/M15_ACLK] \
  [get_bd_pins ps7_0_axi_periph/M16_ACLK] [get_bd_pins ps7_0_axi_periph/M17_ACLK] [get_bd_pins ps7_0_axi_periph/M18_ACLK] \
  [get_bd_pins ps7_0_axi_periph/M19_ACLK] [get_bd_pins ps7_0_axi_periph/M20_ACLK] [get_bd_pins ps7_0_axi_periph/M21_ACLK] \
  [get_bd_pins ps7_0_axi_periph/M22_ACLK] [get_bd_pins ps7_0_axi_periph/M23_ACLK] [get_bd_pins ps7_0_axi_periph/M24_ACLK] \
  [get_bd_pins ps7_0_axi_periph/M25_ACLK] [get_bd_pins ps7_0_axi_periph/M26_ACLK] [get_bd_pins ps7_0_axi_periph/M27_ACLK] \
  [get_bd_pins ps7_0_axi_periph/M28_ACLK]
connect_bd_net [get_bd_pins rst_ps7_0_100M/peripheral_aresetn] \
  [get_bd_pins S00_ARESETN] [get_bd_pins ps7_0_axi_periph/S00_ARESETN] [get_bd_pins ps7_0_axi_periph/M00_ARESETN] \
  [get_bd_pins ps7_0_axi_periph/M01_ARESETN] [get_bd_pins ps7_0_axi_periph/M02_ARESETN] \
  [get_bd_pins ps7_0_axi_periph/M03_ARESETN] [get_bd_pins ps7_0_axi_periph/M04_ARESETN] \
  [get_bd_pins ps7_0_axi_periph/M05_ARESETN] [get_bd_pins ps7_0_axi_periph/M06_ARESETN] \
  [get_bd_pins ps7_0_axi_periph/M07_ARESETN] [get_bd_pins ps7_0_axi_periph/M08_ARESETN] \
  [get_bd_pins ps7_0_axi_periph/M09_ARESETN] [get_bd_pins ps7_0_axi_periph/M10_ARESETN] \
  [get_bd_pins ps7_0_axi_periph/M11_ARESETN] [get_bd_pins ps7_0_axi_periph/M12_ARESETN] \
  [get_bd_pins ps7_0_axi_periph/M13_ARESETN] [get_bd_pins ps7_0_axi_periph/M14_ARESETN] \
  [get_bd_pins ps7_0_axi_periph/M15_ARESETN] [get_bd_pins ps7_0_axi_periph/M16_ARESETN] \
  [get_bd_pins ps7_0_axi_periph/M17_ARESETN] [get_bd_pins ps7_0_axi_periph/M18_ARESETN] \
  [get_bd_pins ps7_0_axi_periph/M19_ARESETN] [get_bd_pins ps7_0_axi_periph/M20_ARESETN] \
  [get_bd_pins ps7_0_axi_periph/M21_ARESETN] [get_bd_pins ps7_0_axi_periph/M22_ARESETN] \
  [get_bd_pins ps7_0_axi_periph/M23_ARESETN] [get_bd_pins ps7_0_axi_periph/M24_ARESETN] \
  [get_bd_pins ps7_0_axi_periph/M25_ARESETN] [get_bd_pins ps7_0_axi_periph/M26_ARESETN] \
  [get_bd_pins ps7_0_axi_periph/M27_ARESETN] [get_bd_pins ps7_0_axi_periph/M28_ARESETN]
connect_bd_net [get_bd_pins rst_ps7_0_100M/interconnect_aresetn] [get_bd_pins ps7_0_axi_periph/ARESETN]
connect_bd_net [get_bd_pins IRQ_F2P] [get_bd_pins processing_system7_0/IRQ_F2P]

current_bd_instance /hier_powerstack
connect_bd_intf_net [get_bd_intf_pins S00_AXI1] [get_bd_intf_pins amdc_pwm_mux_0/S00_AXI]
connect_bd_intf_net [get_bd_intf_pins S00_AXI2] [get_bd_intf_pins amdc_inv_status_mux_0/S00_AXI]
connect_bd_intf_net [get_bd_intf_pins S00_AXI] [get_bd_intf_pins amdc_inverters_0/S00_AXI]
connect_bd_net [get_bd_pins amdc_inverters_0/inverter1_pwm] [get_bd_pins amdc_pwm_mux_0/i_INV1_PWM]
connect_bd_net [get_bd_pins amdc_inverters_0/inverter2_pwm] [get_bd_pins amdc_pwm_mux_0/i_INV2_PWM]
connect_bd_net [get_bd_pins amdc_inverters_0/inverter3_pwm] [get_bd_pins amdc_pwm_mux_0/i_INV3_PWM]
connect_bd_net [get_bd_pins amdc_inverters_0/inverter4_pwm] [get_bd_pins amdc_pwm_mux_0/i_INV4_PWM]
connect_bd_net [get_bd_pins amdc_inverters_0/inverter5_pwm] [get_bd_pins amdc_pwm_mux_0/i_INV5_PWM]
connect_bd_net [get_bd_pins amdc_inverters_0/inverter6_pwm] [get_bd_pins amdc_pwm_mux_0/i_INV6_PWM]
connect_bd_net [get_bd_pins amdc_inverters_0/inverter7_pwm] [get_bd_pins amdc_pwm_mux_0/i_INV7_PWM]
connect_bd_net [get_bd_pins amdc_inverters_0/inverter8_pwm] [get_bd_pins amdc_pwm_mux_0/i_INV8_PWM]
connect_bd_net -net processing_system7_0_FCLK_CLK0 [get_bd_pins s00_axi_aclk] \
  [get_bd_pins amdc_pwm_mux_0/s00_axi_aclk] [get_bd_pins amdc_inverters_0/s00_axi_aclk] \
  [get_bd_pins amdc_inverters_0/CLK_PWM] [get_bd_pins amdc_inv_status_mux_0/s00_axi_aclk]
connect_bd_net [get_bd_pins amdc_inverters_0/carrier_high] [get_bd_pins carrier_high]
connect_bd_net [get_bd_pins amdc_inverters_0/carrier_low] [get_bd_pins carrier_low]
connect_bd_net -net rst_ps7_0_100M_peripheral_aresetn [get_bd_pins s00_axi_aresetn] \
  [get_bd_pins amdc_pwm_mux_0/s00_axi_aresetn] [get_bd_pins amdc_inverters_0/s00_axi_aresetn] \
  [get_bd_pins amdc_inv_status_mux_0/s00_axi_aresetn]
connect_bd_net [get_bd_pins amdc_pwm_mux_0/o_INV1_PWM] [get_bd_pins inverter1_pwm]
connect_bd_net [get_bd_pins amdc_pwm_mux_0/o_INV2_PWM] [get_bd_pins inverter2_pwm]
connect_bd_net [get_bd_pins amdc_pwm_mux_0/o_INV3_PWM] [get_bd_pins inverter3_pwm]
connect_bd_net [get_bd_pins amdc_pwm_mux_0/o_INV4_PWM] [get_bd_pins inverter4_pwm]
connect_bd_net [get_bd_pins amdc_pwm_mux_0/o_INV5_PWM] [get_bd_pins inverter5_pwm]
connect_bd_net [get_bd_pins amdc_pwm_mux_0/o_INV6_PWM] [get_bd_pins inverter6_pwm]
connect_bd_net [get_bd_pins amdc_pwm_mux_0/o_INV7_PWM] [get_bd_pins inverter7_pwm]
connect_bd_net [get_bd_pins amdc_pwm_mux_0/o_INV8_PWM] [get_bd_pins inverter8_pwm]
connect_bd_net [get_bd_pins inverter_sts_c] [get_bd_pins amdc_inv_status_mux_0/sts_c_ext]
connect_bd_net [get_bd_pins inverter_sts_d] [get_bd_pins amdc_inv_status_mux_0/sts_d_ext]
connect_bd_net [get_bd_pins amdc_inverters_0/rst] [get_bd_pins amdc_inv_status_mux_0/sts_a_int]
connect_bd_net [get_bd_pins amdc_inv_status_mux_0/sts_d_int] [get_bd_pins amdc_inverters_0/flt_temp]
connect_bd_net [get_bd_pins amdc_inv_status_mux_0/sts_c_int] [get_bd_pins amdc_inverters_0/flt_desat]
connect_bd_net [get_bd_pins amdc_inv_status_mux_0/sts_b_int] [get_bd_pins amdc_inverters_0/rdy]
connect_bd_net [get_bd_pins device1_out] [get_bd_pins amdc_inv_status_mux_0/device1_out]
connect_bd_net [get_bd_pins inverter_sts_a] [get_bd_pins amdc_inv_status_mux_0/sts_a_ext]
connect_bd_net [get_bd_pins inverter_sts_b] [get_bd_pins amdc_inv_status_mux_0/sts_b_ext]
connect_bd_net -net device3_out_1 [get_bd_pins xlconstant_3/dout] \
  [get_bd_pins amdc_inv_status_mux_0/device3_out] [get_bd_pins amdc_inv_status_mux_0/device4_out] \
  [get_bd_pins amdc_inv_status_mux_0/device5_out] [get_bd_pins amdc_inv_status_mux_0/device6_out] \
  [get_bd_pins amdc_inv_status_mux_0/device7_out] [get_bd_pins amdc_inv_status_mux_0/device8_out] \
  [get_bd_pins amdc_inv_status_mux_0/device2_out]

current_bd_instance /hier_gpio_0
connect_bd_intf_net [get_bd_intf_pins S00_AXI1] [get_bd_intf_pins amdc_eddy_current_se_0/S00_AXI]
connect_bd_intf_net [get_bd_intf_pins S00_AXI2] [get_bd_intf_pins hier_amds_0/S00_AXI]
connect_bd_intf_net [get_bd_intf_pins S00_AXI3] [get_bd_intf_pins hier_ild1420_0/S00_AXI]
connect_bd_intf_net [get_bd_intf_pins S00_AXI] [get_bd_intf_pins amdc_gp3io_mux_0/S00_AXI]
connect_bd_intf_net [get_bd_intf_pins S00_AXI4] [get_bd_intf_pins hier_ild1420_0/S00_AXI1]
connect_bd_net -net gpio1_in_1 [get_bd_pins gpio_in] [get_bd_pins amdc_gp3io_mux_0/port_in]
connect_bd_net [get_bd_pins amdc_gp3io_mux_0/port_out] [get_bd_pins gpio_out]
connect_bd_net -net processing_system7_0_FCLK_CLK0 [get_bd_pins s00_axi_aclk] \
  [get_bd_pins hier_amds_0/s00_axi_aclk] [get_bd_pins amdc_eddy_current_se_0/s00_axi_aclk] \
  [get_bd_pins hier_ild1420_0/s00_axi_aclk] [get_bd_pins amdc_gp3io_mux_0/s00_axi_aclk]
connect_bd_net -net rst_ps7_0_100M_peripheral_aresetn [get_bd_pins s00_axi_aresetn] \
  [get_bd_pins hier_amds_0/s00_axi_aresetn] [get_bd_pins amdc_eddy_current_se_0/s00_axi_aresetn] \
  [get_bd_pins hier_ild1420_0/s00_axi_aresetn] [get_bd_pins amdc_gp3io_mux_0/s00_axi_aresetn]
connect_bd_net [get_bd_pins pwm_carrier_low] [get_bd_pins hier_amds_0/pwm_carrier_low]
connect_bd_net [get_bd_pins pwm_carrier_high] [get_bd_pins hier_amds_0/pwm_carrier_high]
connect_bd_net [get_bd_pins xlconstant_0/dout] [get_bd_pins amdc_gp3io_mux_0/device3_out] [get_bd_pins amdc_gp3io_mux_0/device4_out]
connect_bd_net [get_bd_pins hier_amds_0/dout] [get_bd_pins xlconcat_0/In0]
connect_bd_net [get_bd_pins xlconcat_0/dout] [get_bd_pins amdc_gp3io_mux_0/device1_out]
connect_bd_net [get_bd_pins xlconstant_1/dout] [get_bd_pins xlconcat_0/In1] [get_bd_pins xlconcat_1/In1]
connect_bd_net [get_bd_pins amdc_eddy_current_se_0/sensor_control_out] [get_bd_pins xlconcat_1/In0]
connect_bd_net [get_bd_pins xlconcat_1/dout] [get_bd_pins amdc_gp3io_mux_0/device2_out]
connect_bd_net [get_bd_pins amdc_gp3io_mux_0/device1_in] [get_bd_pins xlslice_0/Din]
connect_bd_net [get_bd_pins xlslice_0/Dout] [get_bd_pins hier_amds_0/Din]
connect_bd_net [get_bd_pins amdc_gp3io_mux_0/device2_in] [get_bd_pins xlslice_1/Din]
connect_bd_net [get_bd_pins xlslice_1/Dout] [get_bd_pins amdc_eddy_current_se_0/sensor_data_in]
connect_bd_net [get_bd_pins amdc_gp3io_mux_0/device3_in] [get_bd_pins xlslice_2/Din]
connect_bd_net -net Din_1 [get_bd_pins xlslice_2/Dout] [get_bd_pins hier_ild1420_0/Din]

current_bd_instance /hier_gpio_0/hier_amds_0
connect_bd_intf_net [get_bd_intf_pins S00_AXI] [get_bd_intf_pins amdc_motherboard_0/S00_AXI]
connect_bd_net [get_bd_pins xlslice_0/Dout] [get_bd_pins amdc_motherboard_0/motherboard_dout1]
connect_bd_net [get_bd_pins amdc_motherboard_0/motherboard_sync_adc] [get_bd_pins xlconcat_2/In0]
connect_bd_net [get_bd_pins amdc_motherboard_0/motherboard_sync_tx] [get_bd_pins xlconcat_2/In1]
connect_bd_net [get_bd_pins xlslice_1/Dout] [get_bd_pins amdc_motherboard_0/motherboard_dout2]
connect_bd_net -net amdc_gpio_mux_0_device_in_2 [get_bd_pins Din] [get_bd_pins xlslice_1/Din] [get_bd_pins xlslice_0/Din]
connect_bd_net [get_bd_pins xlconcat_2/dout] [get_bd_pins dout]
connect_bd_net -net amdc_inverters_0_carrier_low [get_bd_pins pwm_carrier_low] [get_bd_pins amdc_motherboard_0/pwm_carrier_low]
connect_bd_net -net amdc_inverters_0_carrier_high [get_bd_pins pwm_carrier_high] [get_bd_pins amdc_motherboard_0/pwm_carrier_high]
connect_bd_net -net processing_system7_0_FCLK_CLK0 [get_bd_pins s00_axi_aclk] [get_bd_pins amdc_motherboard_0/s00_axi_aclk]
connect_bd_net -net rst_ps7_0_100M_peripheral_aresetn [get_bd_pins s00_axi_aresetn] [get_bd_pins amdc_motherboard_0/s00_axi_aresetn]

current_bd_instance /hier_gpio_0/hier_ild1420_0
connect_bd_intf_net [get_bd_intf_pins S00_AXI1] [get_bd_intf_pins amdc_ild1420_1/S00_AXI]
connect_bd_intf_net [get_bd_intf_pins S00_AXI] [get_bd_intf_pins amdc_ild1420_0/S00_AXI]
connect_bd_net [get_bd_pins xlslice_0/Dout] [get_bd_pins amdc_ild1420_0/din]
connect_bd_net [get_bd_pins xlslice_1/Dout] [get_bd_pins amdc_ild1420_1/din]
connect_bd_net -net amdc_gpio_mux_0_device_in_3 [get_bd_pins Din] [get_bd_pins xlslice_1/Din] [get_bd_pins xlslice_0/Din]
connect_bd_net -net processing_system7_0_FCLK_CLK0 [get_bd_pins s00_axi_aclk] \
  [get_bd_pins amdc_ild1420_0/s00_axi_aclk] [get_bd_pins amdc_ild1420_1/s00_axi_aclk]
connect_bd_net -net rst_ps7_0_100M_peripheral_aresetn [get_bd_pins s00_axi_aresetn] \
  [get_bd_pins amdc_ild1420_0/s00_axi_aresetn] [get_bd_pins amdc_ild1420_1/s00_axi_aresetn]

current_bd_instance /hier_timers
connect_bd_intf_net [get_bd_intf_pins S_AXI1] [get_bd_intf_pins control_timer_1/S_AXI]
connect_bd_intf_net [get_bd_intf_pins S_AXI] [get_bd_intf_pins control_timer_0/S_AXI]
connect_bd_net [get_bd_pins xlconstant_1/dout] [get_bd_pins control_timer_1/freeze] [get_bd_pins control_timer_0/freeze]
connect_bd_net -net processing_system7_0_FCLK_CLK0 [get_bd_pins s_axi_aclk] \
  [get_bd_pins control_timer_1/s_axi_aclk] [get_bd_pins control_timer_0/s_axi_aclk]
connect_bd_net -net rst_ps7_0_100M_peripheral_aresetn [get_bd_pins s_axi_aresetn] \
  [get_bd_pins control_timer_1/s_axi_aresetn] [get_bd_pins control_timer_0/s_axi_aresetn]
connect_bd_net [get_bd_pins control_timer_1/interrupt] [get_bd_pins xlconcat_0/In1]
connect_bd_net [get_bd_pins control_timer_0/interrupt] [get_bd_pins xlconcat_0/In0]
connect_bd_net [get_bd_pins xlconcat_0/dout] [get_bd_pins dout]

current_bd_instance /hier_gpio_1
connect_bd_intf_net [get_bd_intf_pins S00_AXI4] [get_bd_intf_pins hier_ild1420_0/S00_AXI1]
connect_bd_intf_net [get_bd_intf_pins S00_AXI] [get_bd_intf_pins amdc_gp3io_mux_0/S00_AXI]
connect_bd_intf_net [get_bd_intf_pins S00_AXI1] [get_bd_intf_pins amdc_eddy_current_se_0/S00_AXI]
connect_bd_intf_net [get_bd_intf_pins S00_AXI2] [get_bd_intf_pins hier_amds_0/S00_AXI]
connect_bd_intf_net [get_bd_intf_pins S00_AXI3] [get_bd_intf_pins hier_ild1420_0/S00_AXI]
connect_bd_net -net gpio1_in_1 [get_bd_pins gpio_in] [get_bd_pins amdc_gp3io_mux_0/port_in]
connect_bd_net [get_bd_pins amdc_gp3io_mux_0/port_out] [get_bd_pins gpio_out]
connect_bd_net -net processing_system7_0_FCLK_CLK0 [get_bd_pins s00_axi_aclk] \
  [get_bd_pins hier_amds_0/s00_axi_aclk] [get_bd_pins amdc_eddy_current_se_0/s00_axi_aclk] \
  [get_bd_pins hier_ild1420_0/s00_axi_aclk] [get_bd_pins amdc_gp3io_mux_0/s00_axi_aclk]
connect_bd_net -net rst_ps7_0_100M_peripheral_aresetn [get_bd_pins s00_axi_aresetn] \
  [get_bd_pins hier_amds_0/s00_axi_aresetn] [get_bd_pins amdc_eddy_current_se_0/s00_axi_aresetn] \
  [get_bd_pins hier_ild1420_0/s00_axi_aresetn] [get_bd_pins amdc_gp3io_mux_0/s00_axi_aresetn]
connect_bd_net [get_bd_pins pwm_carrier_low] [get_bd_pins hier_amds_0/pwm_carrier_low]
connect_bd_net [get_bd_pins pwm_carrier_high] [get_bd_pins hier_amds_0/pwm_carrier_high]
connect_bd_net [get_bd_pins xlconstant_0/dout] [get_bd_pins amdc_gp3io_mux_0/device3_out] [get_bd_pins amdc_gp3io_mux_0/device4_out]
connect_bd_net [get_bd_pins hier_amds_0/dout] [get_bd_pins xlconcat_0/In0]
connect_bd_net [get_bd_pins xlconcat_0/dout] [get_bd_pins amdc_gp3io_mux_0/device1_out]
connect_bd_net [get_bd_pins xlconstant_1/dout] [get_bd_pins xlconcat_0/In1] [get_bd_pins xlconcat_1/In1]
connect_bd_net [get_bd_pins amdc_eddy_current_se_0/sensor_control_out] [get_bd_pins xlconcat_1/In0]
connect_bd_net [get_bd_pins xlconcat_1/dout] [get_bd_pins amdc_gp3io_mux_0/device2_out]
connect_bd_net [get_bd_pins amdc_gp3io_mux_0/device1_in] [get_bd_pins xlslice_0/Din]
connect_bd_net [get_bd_pins xlslice_0/Dout] [get_bd_pins hier_amds_0/Din]
connect_bd_net [get_bd_pins amdc_gp3io_mux_0/device2_in] [get_bd_pins xlslice_1/Din]
connect_bd_net [get_bd_pins xlslice_1/Dout] [get_bd_pins amdc_eddy_current_se_0/sensor_data_in]
connect_bd_net [get_bd_pins amdc_gp3io_mux_0/device3_in] [get_bd_pins xlslice_2/Din]
connect_bd_net -net Din_1 [get_bd_pins xlslice_2/Dout] [get_bd_pins hier_ild1420_0/Din]
